# Altium project ICP20100BreakOut.PrjPcb
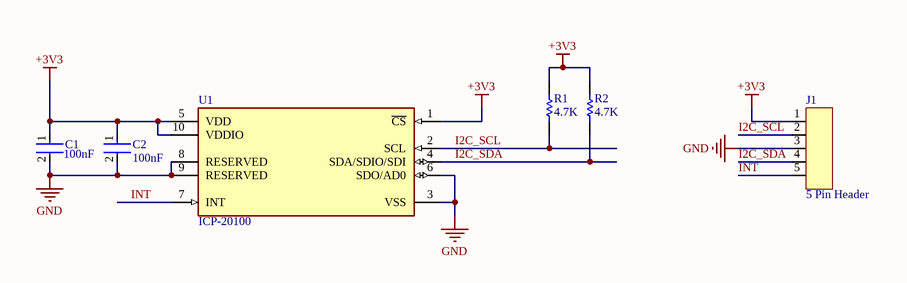
[diagram p0: Schematic.SchDoc]
1 sheet, 6 parts. Net scope: global (net labels, ports and power ports of the same name join across sheets).
Board file: PCB.PcbDoc

## Sheet Schematic.SchDoc
size A4; SheetNumber: 1; SheetTotal: 1

### Parts
C1  100nF  [FP-CC0805-0_85-MFG]
C2  100nF  [FP-CC0805-0_85-MFG]
J1  5 Pin Header  [5Pin 100mils Connector]
R1  4.7K  [YAGO-RC0805_M]
R2  4.7K  [YAGO-RC0805_M]
U1  ICP-20100  [FP-ICP-20100-MFG]

### Nets
+3V3: C1.1 C2.1 J1.1 R1.1 R2.1 U1.1(~{CS}) U1.5(VDD) U1.10(VDDIO)
GND: C1.2 C2.2 J1.3 U1.3(VSS) U1.6(SDO/AD0) U1.8(RESERVED) U1.9(RESERVED)
I2C_SCL: J1.2 R1.2 U1.2(SCL)
I2C_SDA: J1.4 R2.2 U1.4(SDA/SDIO/SDI)
INT: J1.5 U1.7(INT)

### Library data of the parts
C1 C2 = CMP-2100-03606-3: CAP CER 0.1UF 50V X7R 0805 CC0805KRX7R9BB104; Manufacturer: Yageo; Tolerance: 0.1; Material: Ceramic; Device Class L1: Passive Components; ComponentLink2Description: Datasheet; Package: CC0805-0.85; Manufacturer Part Number: CC0805KRX7R9BB104; Digikey Description: CAP CER 0.1UF 50V X7R 0805; Capacitance: 100 nF; Device Class L3: Ceramic Capacitors; Value: 100 nF; Temperature: -30°C to +85°C; Temperature Characteristic: X7R; Voltage Rating: 50 V; Height: 0.95mm; RoHS: TRUE; Ipc Land Pattern Name: CAPC200125X85; Device Class L2: Capacitors; Category: Cap; Temperature Range Low: -30°C; Temperature Range High: +85°C; Mouser Description: Multilayer Ceramic Capacitors MLCC - SMD/SMT 100nF 50V X7R 10%; Footprint Url: http://www.yageo.com/exep/pages/download/literatures/UPY-C_GEN_24.pdf; Automotive: No; Octopart: https://octopart.com/cc0805krx7r9bb104-yageo-192993; Lead Free: Yes; ComponentLink2URL: http://www.yageo.com/documents/recent/UPY-GPHC_Y5V_6.3V-to-50V_8.pdf
J1 = 5Pin 100mils Connector: 5 Pin Vertical Header Connector 100 mils spacing 40 mils hole
R1 R2 = CMP-1568-00001-1: General Puprose Chip Resistor, 4700 Ohm +/- 1%, 0.125 W, -55 to 155 degC, 2-Pin SMD, RoHS, Tape and Reel RC0805FR-074K7L; Tolerance: +/- 1%; Power: 0.125 W; PackageDescription: 2-Pin Surface Mount Device, Body 2 x 1.25 mm; ComponentLink2URL: http://www.yageo.com/documents/recent/PYu-RC_Group_51_RoHS_L-3.pdf; Temperature Min: -55 degC; Packing: Tape and Reel; Mounting Technology: Surface Mount; PartNumber: RC0805FR-074K7L; ComponentLink1URL: http://www.yageo.com/NewPortal/_en/index.jsp; Resistance: 4700 Ohm; Temperature Max: 155 degC; ComponentLink2Description: Datasheet; DatasheetVersion: Rev. 3; RoHS: TRUE; ComponentLink1Description: Manufacturer URL
U1 = CMP-03292-111934633-1: ICP-20100 Barometric Pressure and Temperature Sensor IC Digital Output 1.8V/3.3V 10-Pin LGA T/R; Width: 2mm; Min Length: 1.92mm; Max Thickness: 800µm; NexarPartId: 111934633; Max Width: 2.08mm; Min Operating Temperature: -40°C; Max Length: 2.08mm; Min Width: 1.92mm; Min Thickness: 640µm; Length: 2mm